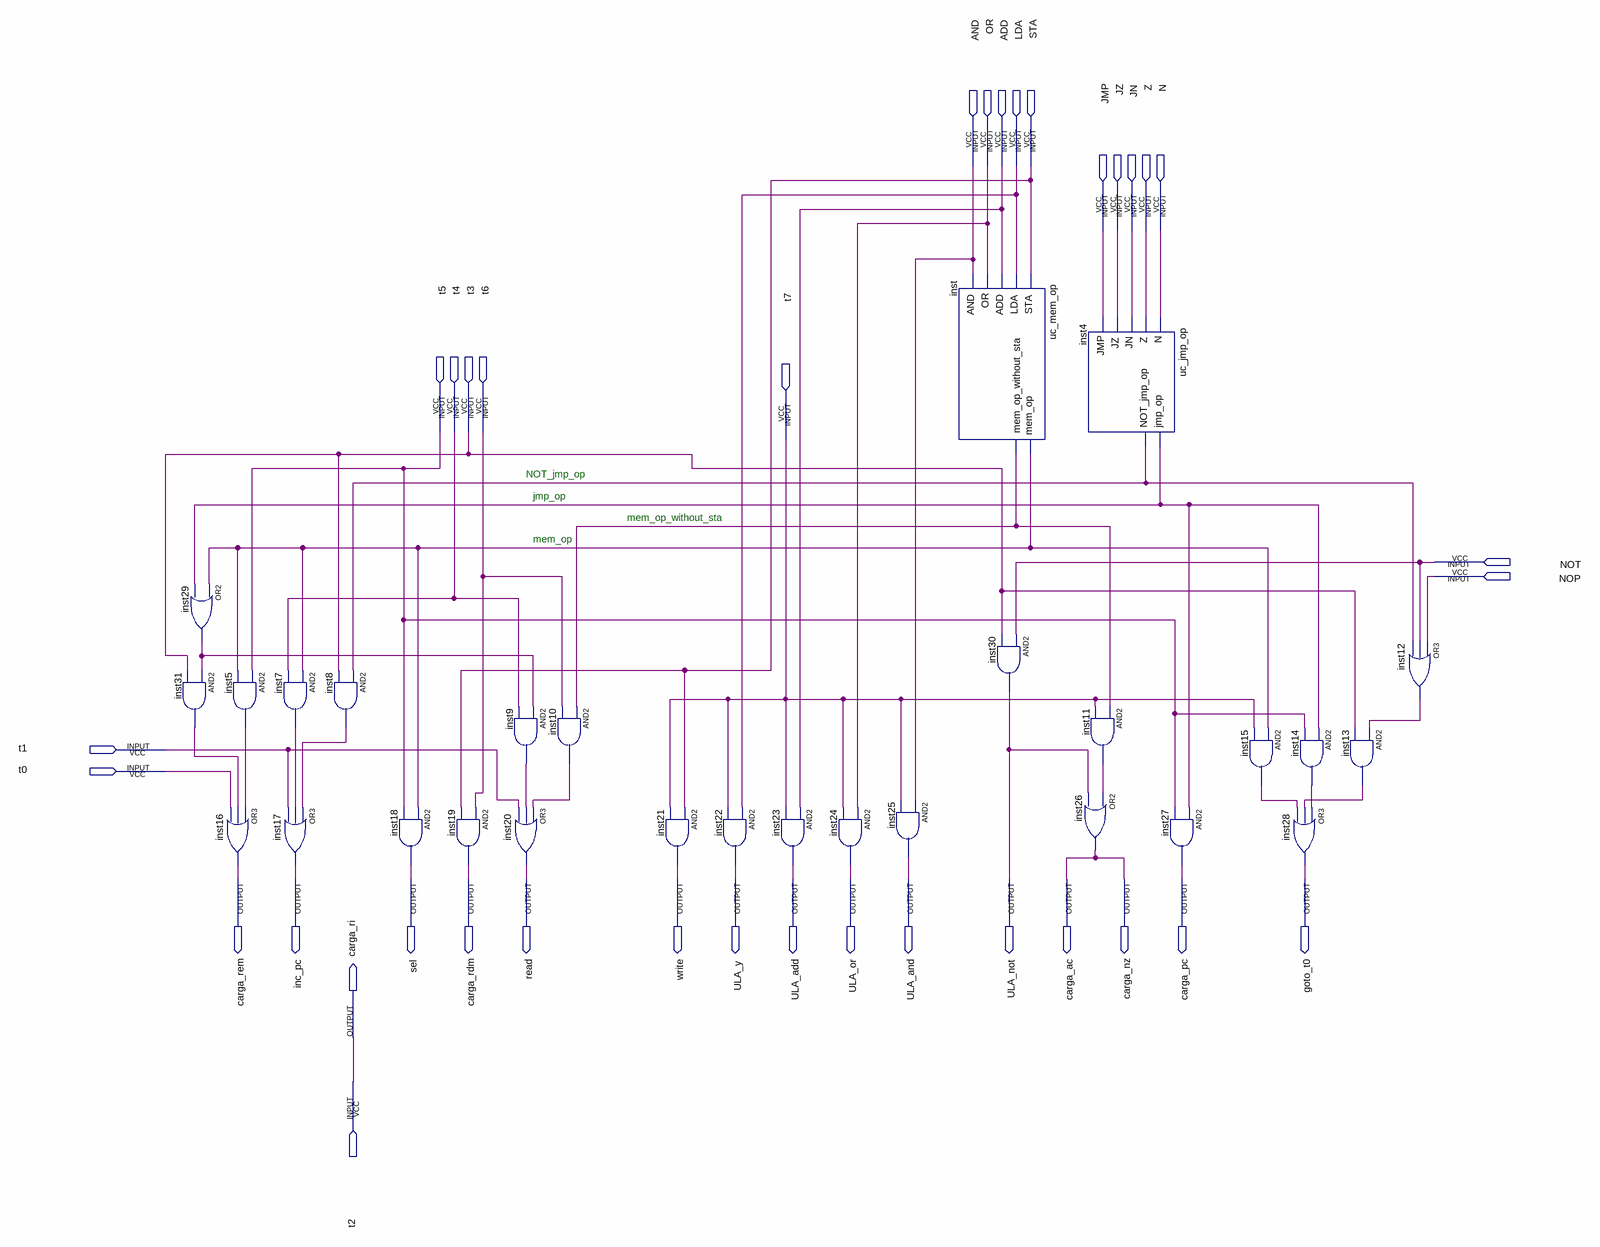
[diagram p0: schematic sheet]
// Quartus schematic uc.bdf as structural Verilog: 28 symbols, 36 pins
module uc (
  input  AND,
  input  OR,
  input  ADD,
  input  LDA,
  input  STA,
  input  JMP,
  input  JZ,
  input  JN,
  input  Z,
  input  N,
  input  t5,
  input  t4,
  input  t3,
  input  t6,
  input  t7,
  input  NOT,
  input  NOP,
  input  t1,
  input  t0,
  input  t2,
  output carga_rem,
  output inc_pc,
  output sel,
  output carga_rdm,
  output read,
  output write,
  output ULA_y,
  output ULA_add,
  output ULA_or,
  output ULA_and,
  output ULA_not,
  output carga_ac,
  output carga_nz,
  output carga_pc,
  output goto_t0,
  output carga_ri
);

  wire inst4_jmp_op, inst4_not_jmp_op, inst5_out, inst7_out, inst8_out, inst9_out, inst10_out, inst11_out,
       inst12_out, inst13_out, inst14_out, inst15_out, inst29_out, inst31_out, inst_mem_op,
       inst_mem_op_without_sta;

  or inst29 (inst29_out, inst_mem_op, inst4_jmp_op);
  and inst31 (inst31_out, inst29_out, t3);
  or inst16 (carga_rem, inst5_out, inst31_out, t0);
  and inst5 (inst5_out, t5, inst_mem_op);
  and inst7 (inst7_out, inst_mem_op, t4);
  or inst17 (inc_pc, inst8_out, inst7_out, t1);
  and inst8 (inst8_out, inst4_not_jmp_op, t3);
  and inst18 (sel, inst_mem_op, t5);
  and inst19 (carga_rdm, t6, STA);
  and inst9 (inst9_out, inst29_out, t4);
  or inst20 (read, inst10_out, inst9_out, t1);
  and inst10 (inst10_out, inst_mem_op_without_sta, t6);
  and inst21 (write, STA, t7);
  and inst22 (ULA_y, LDA, t7);
  and inst23 (ULA_add, ADD, t7);
  and inst24 (ULA_or, OR, t7);
  and inst25 (ULA_and, AND, t7);
  uc_mem_op inst (
    .STA(STA), .LDA(LDA), .ADD(ADD), .OR(OR), .AND(AND), .mem_op(inst_mem_op),
    .mem_op_without_sta(inst_mem_op_without_sta));
  and inst30 (ULA_not, NOT, t3);
  uc_jmp_op inst4 (.N(N), .Z(Z), .JN(JN), .JZ(JZ), .JMP(JMP), .jmp_op(inst4_jmp_op), .NOT_jmp_op(inst4_not_jmp_op));
  and inst11 (inst11_out, inst_mem_op_without_sta, t7);
  or inst26 (carga_ac, inst11_out, ULA_not);
  and inst27 (carga_pc, inst4_jmp_op, t5);
  and inst15 (inst15_out, inst_mem_op, t7);
  and inst14 (inst14_out, inst4_jmp_op, t5);
  or inst28 (goto_t0, inst14_out, inst13_out, inst15_out);
  and inst13 (inst13_out, inst12_out, t3);
  or inst12 (inst12_out, NOP, NOT, inst4_not_jmp_op);

  assign carga_nz = carga_ac;
  assign carga_ri = t2;

  // Notes on the sheet:
  //   NOT_jmp_op
  //   jmp_op
  //   mem_op_without_sta
  //   mem_op
endmodule
